# Altium schematic sheet Power_MPU.SchDoc: Power MPU
size A3; Date: Not used; ApprovedBy: Not used; CheckedBy: Not used; Author: Not used; CompanyName: STMicroelectronics; DrawnBy: Not used; Engineer: Not used; Organization: Not used; Address1: Not used; Address2: Not used; Address3: Not used; Address4: Not used; DocumentNumber: Not used; Revision: Not used; SheetNumber: 5; SheetTotal: 18; CurrentTime: Not used; CurrentDate: Not used; Time: Not used; DocumentFullPathAndName: Not used; DocumentName: Not used; ModifiedDate: Not used; ImagePath: Not used; ProjectName: Not used; Application_BuildNumber: Not used
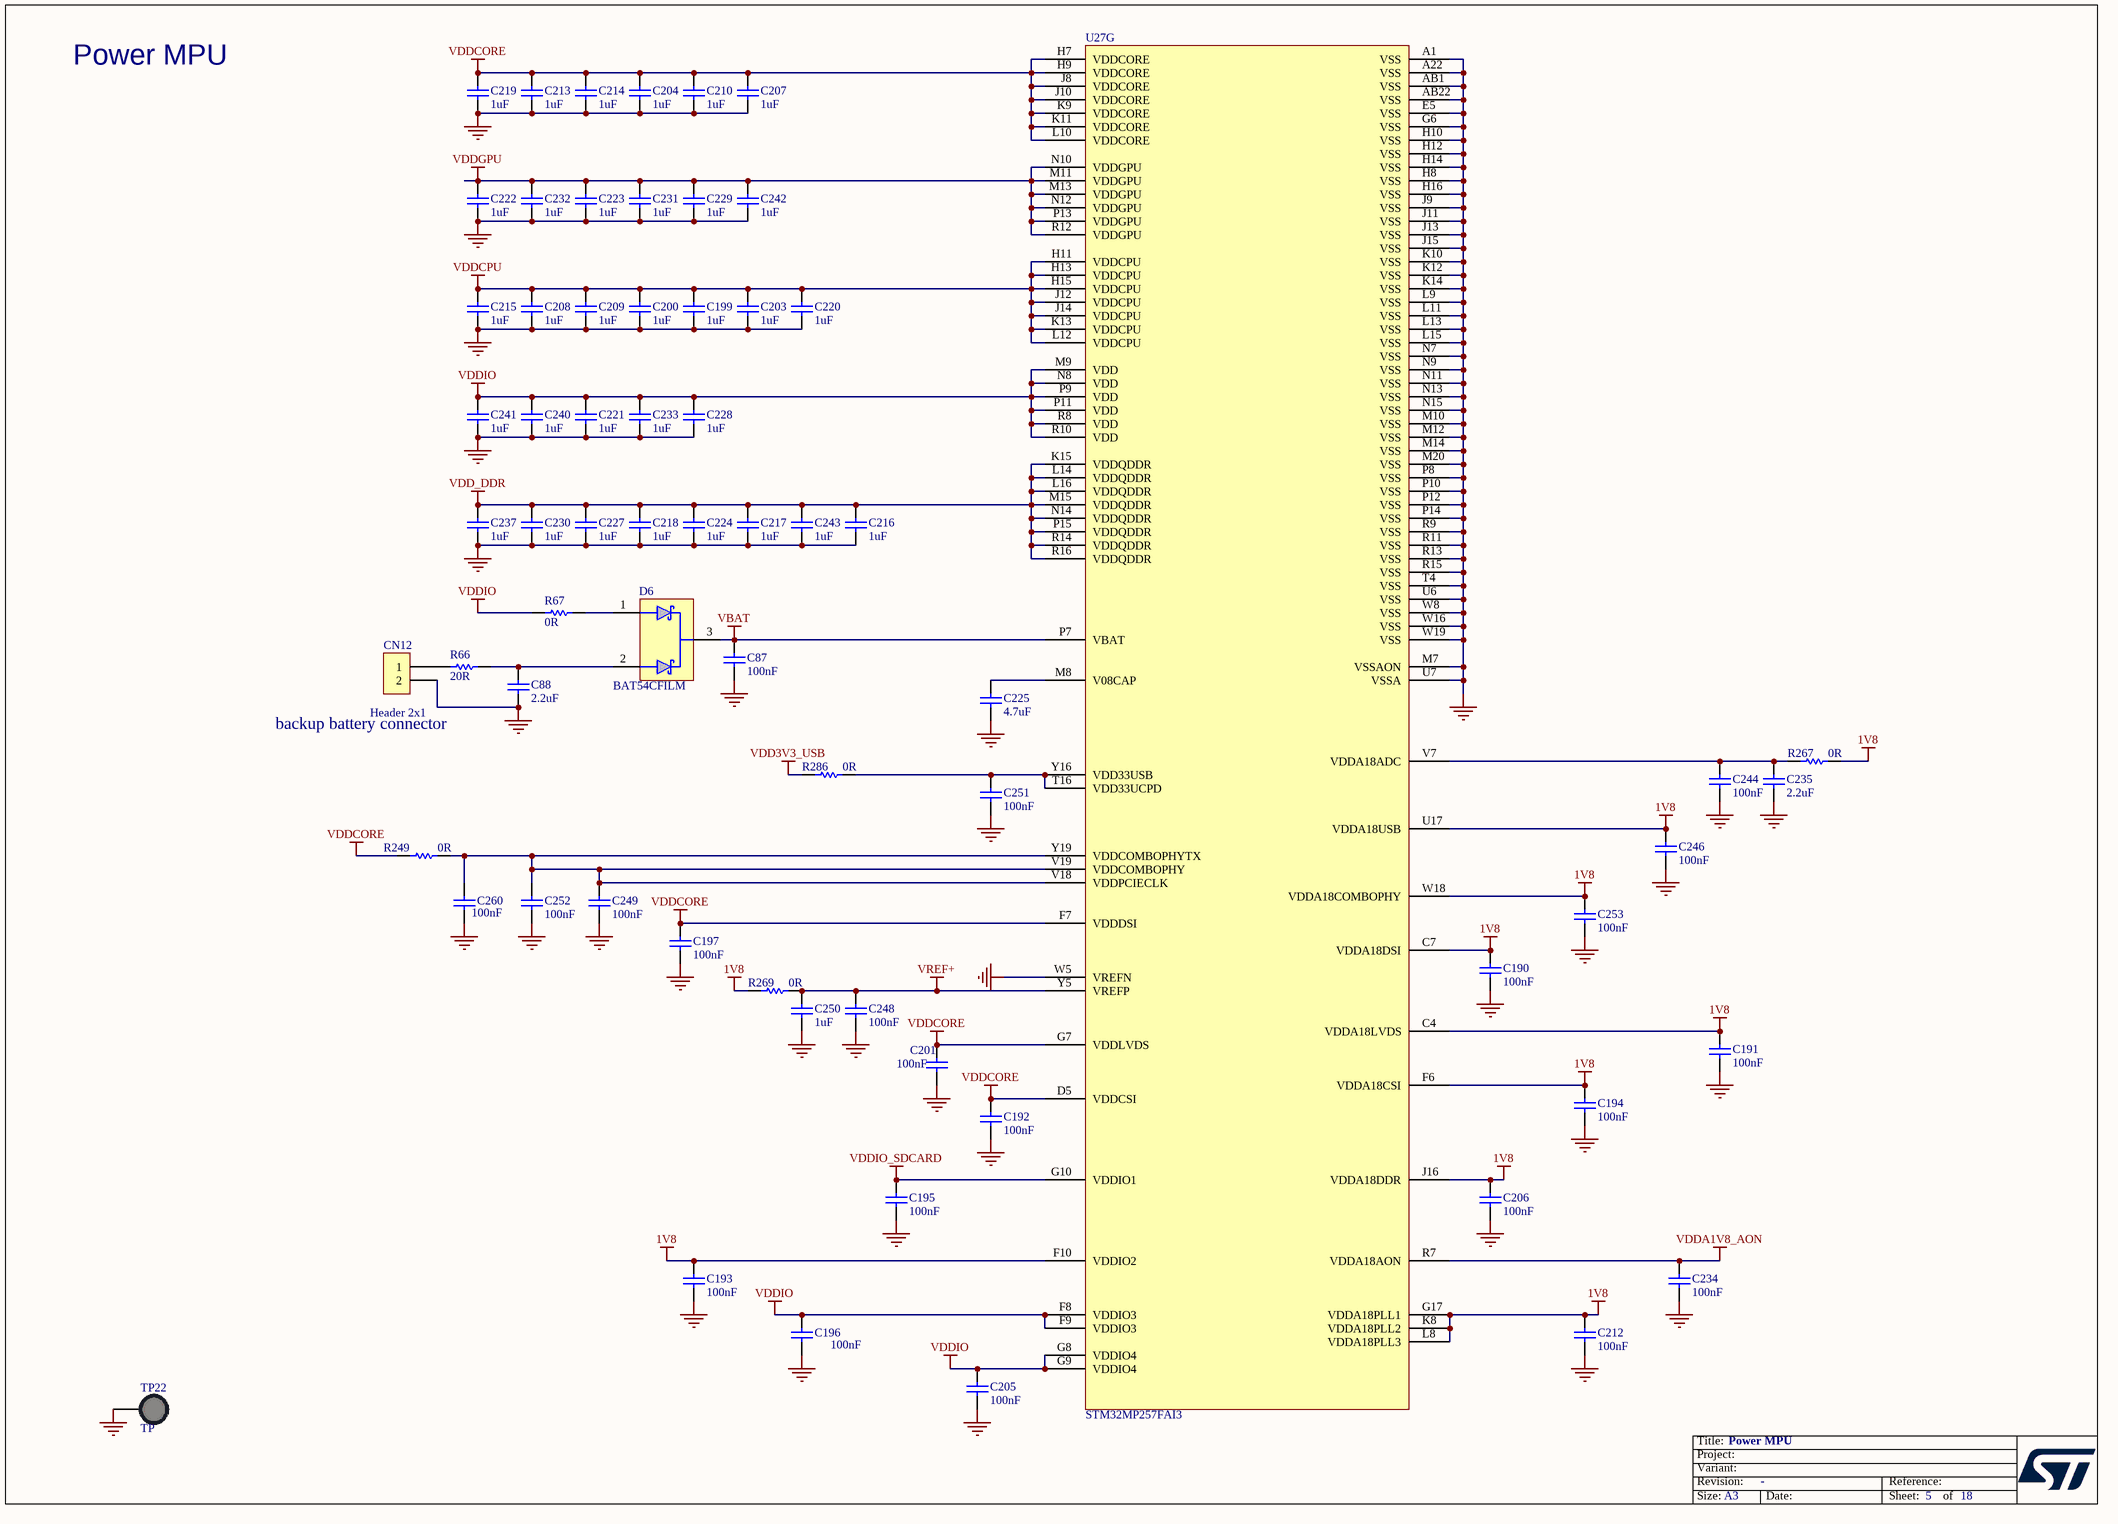
[diagram p0: Power_MPU.SchDoc]

## Parts
C87  value 100nF  [C0402]
C88  value 2.2uF  [C0402]  (hidden comment: Capacitor)
C190  value 100nF  [C0201_MURATA_GRM033_H0P3]  (hidden comment: Capacitor)
C191  value 100nF  [C0201_MURATA_GRM033_H0P3]  (hidden comment: Capacitor)
C192  value 100nF  [C0201_MURATA_GRM033_H0P3]  (hidden comment: Capacitor)
C193  value 100nF  [C0201_MURATA_GRM033_H0P3]  (hidden comment: Capacitor)
C194  value 100nF  [C0201_MURATA_GRM033_H0P3]  (hidden comment: Capacitor)
C195  value 100nF  [C0201_MURATA_GRM033_H0P3]  (hidden comment: Capacitor)
C196  value 100nF  [C0201_MURATA_GRM033_H0P3]  (hidden comment: Capacitor)
C197  value 100nF  [C0201_MURATA_GRM033_H0P3]  (hidden comment: Capacitor)
C199  value 1uF  [C0201_MURATA_GRM033_H0P3]  (hidden comment: Capacitor)
C200  value 1uF  [C0201_MURATA_GRM033_H0P3]  (hidden comment: Capacitor)
C201  value 100nF  [C0201_MURATA_GRM033_H0P3]  (hidden comment: Capacitor)
C203  value 1uF  [C0201_MURATA_GRM033_H0P3]  (hidden comment: Capacitor)
C204  value 1uF  [C0201_MURATA_GRM033_H0P3]  (hidden comment: Capacitor)
C205  value 100nF  [C0201_MURATA_GRM033_H0P3]  (hidden comment: Capacitor)
C206  value 100nF  [C0201_MURATA_GRM033_H0P3]  (hidden comment: Capacitor)
C207  value 1uF  [C0201_MURATA_GRM033_H0P3]  (hidden comment: Capacitor)
C208  value 1uF  [C0201_MURATA_GRM033_H0P3]  (hidden comment: Capacitor)
C209  value 1uF  [C0201_MURATA_GRM033_H0P3]  (hidden comment: Capacitor)
C210  value 1uF  [C0201_MURATA_GRM033_H0P3]  (hidden comment: Capacitor)
C212  value 100nF  [C0201_MURATA_GRM033_H0P3]  (hidden comment: Capacitor)
C213  value 1uF  [C0201_MURATA_GRM033_H0P3]  (hidden comment: Capacitor)
C214  value 1uF  [C0201_MURATA_GRM033_H0P3]  (hidden comment: Capacitor)
C215  value 1uF  [C0201_MURATA_GRM033_H0P3]  (hidden comment: Capacitor)
C216  value 1uF  [C0201_MURATA_GRM033_H0P3]  (hidden comment: Capacitor)
C217  value 1uF  [C0201_MURATA_GRM033_H0P3]  (hidden comment: Capacitor)
C218  value 1uF  [C0201_MURATA_GRM033_H0P3]  (hidden comment: Capacitor)
C219  value 1uF  [C0201_MURATA_GRM033_H0P3]  (hidden comment: Capacitor)
C220  value 1uF  [C0201_MURATA_GRM033_H0P3]  (hidden comment: Capacitor)
C221  value 1uF  [C0201_MURATA_GRM033_H0P3]  (hidden comment: Capacitor)
C222  value 1uF  [C0201_MURATA_GRM033_H0P3]  (hidden comment: Capacitor)
C223  value 1uF  [C0201_MURATA_GRM033_H0P3]  (hidden comment: Capacitor)
C224  value 1uF  [C0201_MURATA_GRM033_H0P3]  (hidden comment: Capacitor)
C225  value 4.7uF  [C0201_H0P5]  (hidden comment: Capacitor)
C227  value 1uF  [C0201_MURATA_GRM033_H0P3]  (hidden comment: Capacitor)
C228  value 1uF  [C0201_MURATA_GRM033_H0P3]  (hidden comment: Capacitor)
C229  value 1uF  [C0201_MURATA_GRM033_H0P3]  (hidden comment: Capacitor)
C230  value 1uF  [C0201_MURATA_GRM033_H0P3]  (hidden comment: Capacitor)
C231  value 1uF  [C0201_MURATA_GRM033_H0P3]  (hidden comment: Capacitor)
C232  value 1uF  [C0201_MURATA_GRM033_H0P3]  (hidden comment: Capacitor)
C233  value 1uF  [C0201_MURATA_GRM033_H0P3]  (hidden comment: Capacitor)
C234  value 100nF  [C0201_MURATA_GRM033_H0P3]  (hidden comment: Capacitor)
C235  value 2.2uF  [C0201_H0P5]  (hidden comment: Capacitor)
C237  value 1uF  [C0201_MURATA_GRM033_H0P3]  (hidden comment: Capacitor)
C240  value 1uF  [C0201_MURATA_GRM033_H0P3]  (hidden comment: Capacitor)
C241  value 1uF  [C0201_MURATA_GRM033_H0P3]  (hidden comment: Capacitor)
C242  value 1uF  [C0201_MURATA_GRM033_H0P3]  (hidden comment: Capacitor)
C243  value 1uF  [C0201_MURATA_GRM033_H0P3]  (hidden comment: Capacitor)
C244  value 100nF  [C0201_MURATA_GRM033_H0P3]  (hidden comment: Capacitor)
C246  value 100nF  [C0201_MURATA_GRM033_H0P3]  (hidden comment: Capacitor)
C248  value 100nF  [C0201_MURATA_GRM033_H0P3]  (hidden comment: Capacitor)
C249  value 100nF  [C0201_MURATA_GRM033_H0P3]  (hidden comment: Capacitor)
C250  value 1uF  [C0201_MURATA_GRM033_H0P3]  (hidden comment: Capacitor)
C251  value 100nF  [C0201_MURATA_GRM033_H0P3]  (hidden comment: Capacitor)
C252  value 100nF  [C0201_MURATA_GRM033_H0P3]  (hidden comment: Capacitor)
C253  value 100nF  [C0201_MURATA_GRM033_H0P3]  (hidden comment: Capacitor)
C260  value 100nF  [C0201_MURATA_GRM033_H0P3]  (hidden comment: Capacitor)
CN12  value Header 2x1  [CON_MOLEX_53047-0210]
D6  value BAT54CFILM  [DIO_SOT23]  (hidden comment: DIODE_3P_DUAL_COMMON_CATHODE)
R66  value 20R  [R0402]  (hidden comment: Resistor)
R67  value 0R  [R0402]  (hidden comment: Resistor)
R249  value 0R  [R0603]  (hidden comment: Resistor)
R267  value 0R  [R0402]
R269  value 0R  [R0402]
R286  value 0R  [R0402]
TP22  value TP  [TP_PTH-1P02MM_TEST-TERMINAL_RS_101-2391_BLACK]  (hidden comment: Test_pin_conn_black)
U27  STM32MP257FAI3  [ICC_LFBGA436_18X18_P080_H1P70_STM32MP257_CODE-B0D1]  (part G of 9)

## Nets
1V8: C190.2 C191.2 C193.2 C194.2 C206.2 C212.2 C246.2 C253.2 R267.2 R269.1 U27.C4(VDDA18LVDS) U27.C7(VDDA18DSI) U27.F6(VDDA18CSI) U27.F10(VDDIO2) U27.G17(VDDA18PLL1) U27.J16(VDDA18DDR) U27.K8(VDDA18PLL2) U27.L8(VDDA18PLL3) U27.U17(VDDA18USB) U27.W18(VDDA18COMBOPHY)
GND: C87.1 C88.1 C190.1 C191.1 C192.1 C193.1 C194.1 C195.1 C196.1 C197.1 C199.1 C200.2 C201.1 C203.1 C204.2 C205.1 C206.1 C207.1 C208.1 C209.1 C210.1 C212.1 C213.1 C214.1 C215.2 C216.1 C217.1 C218.1 C219.2 C220.1 C221.1 C222.1 C223.1 C224.1 C225.1 C227.1 C228.1 C229.2 C230.2 C231.1 C232.1 C233.2 C234.1 C235.1 C237.1 C240.1 C241.2 C242.1 C243.1 C244.1 C246.1 C248.1 C249.1 C250.1 C251.1 C252.1 C253.1 C260.1 CN12.2 TP22.1 U27.A1(VSS) U27.A22(VSS) U27.AB1(VSS) U27.AB22(VSS) U27.E5(VSS) U27.G6(VSS) U27.H8(VSS) U27.H10(VSS) U27.H12(VSS) U27.H14(VSS) U27.H16(VSS) U27.J9(VSS) U27.J11(VSS) U27.J13(VSS) U27.J15(VSS) U27.K10(VSS) U27.K12(VSS) U27.K14(VSS) U27.L9(VSS) U27.L11(VSS) U27.L13(VSS) U27.L15(VSS) U27.M7(VSSAON) U27.M10(VSS) U27.M12(VSS) U27.M14(VSS) U27.M20(VSS) U27.N7(VSS) U27.N9(VSS) U27.N11(VSS) U27.N13(VSS) U27.N15(VSS) U27.P8(VSS) U27.P10(VSS) U27.P12(VSS) U27.P14(VSS) U27.R9(VSS) U27.R11(VSS) U27.R13(VSS) U27.R15(VSS) U27.T4(VSS) U27.U6(VSS) U27.U7(VSSA) U27.W5(VREFN) U27.W8(VSS) U27.W16(VSS) U27.W19(VSS)
VBAT: C87.2 D6.3 U27.P7(VBAT)
VDD3V3_USB: R286.1
VDD_DDR: C216.2 C217.2 C218.2 C224.2 C227.2 C230.1 C237.2 C243.2 U27.K15(VDDQDDR) U27.L14(VDDQDDR) U27.L16(VDDQDDR) U27.M15(VDDQDDR) U27.N14(VDDQDDR) U27.P15(VDDQDDR) U27.R14(VDDQDDR) U27.R16(VDDQDDR)
VDDA1V8_AON: C234.2 U27.R7(VDDA18AON)
VDDCORE: C192.2 C197.2 C201.2 C204.1 C207.2 C210.2 C213.2 C214.2 C219.1 R249.1 U27.D5(VDDCSI) U27.F7(VDDDSI) U27.G7(VDDLVDS) U27.H7(VDDCORE) U27.H9(VDDCORE) U27.J8(VDDCORE) U27.J10(VDDCORE) U27.K9(VDDCORE) U27.K11(VDDCORE) U27.L10(VDDCORE)
VDDCPU: C199.2 C200.1 C203.2 C208.2 C209.2 C215.1 C220.2 U27.H11(VDDCPU) U27.H13(VDDCPU) U27.H15(VDDCPU) U27.J12(VDDCPU) U27.J14(VDDCPU) U27.K13(VDDCPU) U27.L12(VDDCPU)
VDDGPU: C222.2 C223.2 C229.1 C231.2 C232.2 C242.2 U27.M11(VDDGPU) U27.M13(VDDGPU) U27.N10(VDDGPU) U27.N12(VDDGPU) U27.P13(VDDGPU) U27.R12(VDDGPU)
VDDIO: C196.2 C205.2 C221.2 C228.2 C233.1 C240.2 C241.1 R67.2 U27.F8(VDDIO3) U27.F9(VDDIO3) U27.G8(VDDIO4) U27.G9(VDDIO4) U27.M9(VDD) U27.N8(VDD) U27.P9(VDD) U27.P11(VDD) U27.R8(VDD) U27.R10(VDD)
VDDIO_SDCARD: C195.2 U27.G10(VDDIO1)
VREF+: C248.2 C250.2 R269.2 U27.Y5(VREFP)
NetC88_2: C88.2 D6.2 R66.2
NetC225_2: C225.2 U27.M8(V08CAP)
NetC235_2: C235.2 C244.2 R267.1 U27.V7(VDDA18ADC)
NetC249_2: C249.2 C252.2 C260.2 R249.2 U27.V18(VDDPCIECLK) U27.V19(VDDCOMBOPHY) U27.Y19(VDDCOMBOPHYTX)
NetC251_2: C251.2 R286.2 U27.T16(VDD33UCPD) U27.Y16(VDD33USB)
NetCN12_1: CN12.1 R66.1
NetD6_1: D6.1 R67.1

## Notes on the sheet
- Power MPU
- backup battery connector
- Title:
- Project:
- Size:
- Revision:
- Variant:
- A3
- -
- Date:
- Reference:
- Sheet:
- of

## Library data of the parts
C87 = MCD-00006: Capacitor,100nF,16V,X7R,10%,0402; Manufacturer_Part_Number: CC0402KRX7R7BB104; Manufacturer: YAGEO; Alternate_Manufacturer: MURATA; Alternate_Manufacturer_Part_Number: GCM155R71C104KA55D; Part_Preference: Recommended; Partial_Alternate_Internal_Part_Number: MCD-03299; Provided_By: SUBCO; Initial_Board_Reference: MB1274; Order_Code_RS: 616-9701; Component_Country_Of_Origin: China; ID: 2474; ShowFields: YES; Alternate_EMS: M; Internal_Part_Number: MCD-00006; ComponentLink1Description: Datasheet; ECCN_US: n/a; ECCN_EU: n/a; Status: Released; Part_Type: Capacitor; Package: 0402; ComponentLink1URL: http://tunmcdsvn.tun.st.com/Component_Documentation_Library/Trunk/Capacitor/YAGEO_X7R_Series; Order_Code_Digikey: 311-1338-1-ND; Order_Code_Farnell: 9402047
C88 = MCD-01823: Capacitor, MLCC, 2.2uF, 6V3, X5R,+/-10%, 0402, T=0.5mm; Part_Preference: Recommended; Manufacturer: MURATA; Manufacturer_Part_Number: GRM155R60J225KE95D; Order_Code_RS: 172-6478; Component_Country_Of_Origin: Japan; ID: 3923; ShowFields: YES; Internal_Part_Number: MCD-01823; Status: Released; Part_Type: Capacitor; Alternate_Manufacturer: N/A; Alternate_Manufacturer_Part_Number: N/A; Package: 0402; ComponentLink1URL: http://tunmcdsvn.tun.st.com/Component_Documentation_Library/Trunk/Capacitor/MURATA_GRM_Series; Order_Code_Digikey: 490-12532-1-ND; Order_Code_Farnell: 2695865
C190-C197 C201 C205 C206 C212 C234 C244 C246 C248 C249 C251-C253 C260 = MCD-01535: Capacitor, MLCC,100nF, 10V, X7R, +/-10%, 0201, T=0.3mm; Part_Preference: Recommended; Manufacturer: MURATA; Manufacturer_Part_Number: GRM033R61A104KE15; Order_Code_RS: 790-2742; Internal_Part_Number: MCD-01535; Status: Checked; Part_Type: Capacitor; Alternate_Manufacturer: N/A; Alternate_Manufacturer_Part_Number: N/A; Package: 0201; ComponentLink1URL: http://tunmcdsvn.tun.st.com/Component_Documentation_Library/Trunk/Capacitor/MURATA_GRM_Series; Order_Code_Digikey: 490-5881-1-ND; Order_Code_Farnell: 2470450
C199 C200 C203 C204 C207-C210 C213-C224 C227-C233 C237 C240-C243 C250 = MCD-02377: Capacitor, MLCC, 1uF, 6.3V, X5R, +/-20%, 0201, T=0,3mm; Manufacturer_Part_Number: GRM033R60J105MEA2; Manufacturer: MURATA; Part_Preference: Recommended; Order_Code_RS: 820-0643; Status: Checked; Internal_Part_Number: MCD-02377; Part_Type: Capacitor; Alternate_Manufacturer_Part_Number: N/A; Alternate_Manufacturer: N/A; Package: 0201; ComponentLink1URL: http://tunmcdsvn.tun.st.com/Component_Documentation_Library/Trunk/Capacitor/MURATA_GRM_Series/GRM033R60J105MEA2/; Order_Code_Digikey: 490-7229-2-ND; Order_Code_Farnell: 2470448
C225 = MCD-01534: Capacitor, MLCC, 4,7uF, 6V3, X5R, +/-20%, 0201, T=0.5mm; Part_Preference: Recommended; Manufacturer: MURATA; Manufacturer_Part_Number: GRM035R60J475ME15; Internal_Part_Number: MCD-01534; Status: Checked; Part_Type: Capacitor; Alternate_Manufacturer: N/A; Alternate_Manufacturer_Part_Number: N/A; Package: 0201; ComponentLink1URL: http://tunmcdsvn.tun.st.com/Component_Documentation_Library/Trunk/Capacitor/MURATA_GRM_Series; Order_Code_Digikey: 490-13230-1-ND; Order_Code_Farnell: N/A; Order_Code_RS: N/A
C235 = MCD-02235: Capacitor, MLCC, 2.2uF, 10V, X5R,+/-10%, 0201, T=0.5mm; Part_Preference: Recommended; Manufacturer: MURATA; Manufacturer_Part_Number: GRM033R61A225KE47D; Order_Code_RS: NA; Component_Country_Of_Origin: Japan; ShowFields: YES; ID: 4335; Internal_Part_Number: MCD-02235; Status: Checked; Part_Type: Capacitor; Package: 0201; ComponentLink1URL: http://tunmcdsvn.tun.st.com/Component_Documentation_Library/Trunk/Capacitor/MURATA_GRM_Series; Order_Code_Digikey: 490-13227-1-ND; Order_Code_Farnell: NA
CN12 = MCD-00655: Header 2 circuits, 1.25mm Pitch ,  Vertical, with Friction Lock; Part_Type: Connector; Manufacturer_Part_Number: 53047-0210; Manufacturer: MOLEX; BMS_Part_Number: 9083002; Part_Preference: Recommended; Provided_By: SUBCO; Initial_Board_Reference: MB1272; Order_Code_RS: 279-9213; Component_Country_Of_Origin: Unknown; ID: 3091; ShowFields: YES; Internal_Part_Number: MCD-00655; Status: Released; ComponentLink1Description: Datasheet; ComponentLink1URL: http://tunmcdsvn.tun.st.com/Component_Documentation_Library/Trunk/Connector/MOLEX_53047-0210/; ECCN_US: n/a; ECCN_EU: n/a; Alternate_Manufacturer: N/A; Alternate_Manufacturer_Part_Number: N/A; Order_Code_Digikey: WM1731-ND; Order_Code_Farnell: 9733051
D6 = MCD-03280: Diode, Schottky, Dual Common Cathode, 0V3, 300mA, 40V, SOT-23; Part_Preference: Recommended; Manufacturer: STMICROELECTRONICS; Full_Alternate_Internal_Part_Number: BAT54C+, BAT54CLT1G, BAT54C-7-F, BAT54C,215; Order_code_RS: 795-8397; Component_Country_Of_Origin: China; ShowFields: YES; ID: 5396; Order_code_Digikey: N/A; Order_code_Farnell: 9801499; Status: New; ComponentLink1URL: http://tunmcdsvn.tun.st.com/Component_Documentation_Library/Trunk/Diode/STMICROELECTRONICS_BAT54_Series; Internal_Part_Number: MCD-03280; Part_Type: Diode; Manufacturer_Part_Number: BAT54CFILM; Package: SOT-23
R66 = MCD-00058: Resistor, 20R, 0402, +/-1%, 1/16W; BMS_Part_Number: 9131027; Part_Preference: Recommended; Manufacturer: YAGEO; Manufacturer_Part_Number: RC0402FR-0720RL; Component_Country_Of_Origin: China; ID: 2537; ShowFields: YES; Internal_Part_Number: MCD-00058; Status: Released; Part_Type: Resistor; Alternate_Manufacturer: N/A; Alternate_Manufacturer_Part_Number: N/A; Package: 0402; ComponentLink1URL: http://tunmcdsvn.tun.st.com/Component_Documentation_Library/Trunk/Resistor/YAGEO_RC_L_Series; Order_Code_Digikey: 311-20LRCT-ND; Order_Code_Farnell: 1799192; Order_Code_RS: N/A
R67 = MCD-00052: Resistor, 0R, 0402, +/-5%, 1/16W; Manufacturer_Part_Number: RC0402JR-070RL; Manufacturer: YAGEO; Part_Preference: Recommended; Order_Code_RS: 618-5804; Component_Country_Of_Origin: China; ShowFields: YES; ID: 2540; Internal_Part_Number: MCD-00052; Status: Released; Part_Type: Resistor; ComponentLink1URL: http://tunmcdsvn.tun.st.com/Component_Documentation_Library/Trunk/Resistor/YAGEO_RC_L_Series; Package: 0402; Order_Code_Digikey: 311-0.0JRCT-ND; Order_Code_Farnell: 9232516RL
R249 = MCD-00056: Resistor, 0R, 0603, +/-5%, 1/10W; Part_Preference: Recommended; Manufacturer: YAGEO; Manufacturer_Part_Number: RC0603JR-070RL; Component_Country_Of_Origin: China; ShowFields: YES; ID: 2536; Internal_Part_Number: MCD-00056; Status: Released; Part_Type: Resistor; Package: 0603; ComponentLink1URL: http://tunmcdsvn.tun.st.com/Component_Documentation_Library/Trunk/Resistor/YAGEO_RC_L_Series; Order_Code_Digikey: 311-0.0GRCT-ND; Order_Code_Farnell: 9233130RL; Order_Code_RS: N/A
R267 R269 R286 = MCD-00052: Resistor,0R,0402,5%,1/16W; Manufacturer_Part_Number: RC0402JR-070RL; Manufacturer: YAGEO; Part_Preference: Recommended; ECCN_US: EAR99; ECCN_EU: NEC; Provided_By: SUBCO; Initial_Board_Reference: mb1274; Order_Code_RS: 618-5804; Internal_Part_Number: MCD-00052; ComponentLink1Description: Datasheet; Status: Released; Part_Type: Resistor; ComponentLink1URL: http://tunmcdsvn.tun.st.com/Component_Documentation_Library/Trunk/Resistor/YAGEO_RC_L_Series; Package: 0402; Alternate_Manufacturer: N/A; Alternate_Manufacturer_Part_Number: N/A; Order_Code_Digikey: 311-0.0JRCT-ND; Order_Code_Farnell: 9232516RL
TP22 = MCD-00713: Vero Technologies 1.02mm Black Terminal Post; Part_Type: Misc; Manufacturer_Part_Number: 20-2137; Part_Preference: Recommended; Order_Code_RS: 101-2391; Provided_By: SUBCO; Internal_Part_Number: MCD-00713; Status: Released; Manufacturer: VERO; ComponentLink1Description: Datasheet; ComponentLink1URL: http://tunmcdsvn.tun.st.com/Component_Datasheet_Library/Trunk/Misc/Vero_TestPin_20-2137; ECCN_US: n/a; ECCN_EU: n/a
U27 = MCD-02000: MPU, ARM Cortex-A35 + M33 32-bit MPU, 808KB RAM, With Crypto; Part_Type: IC; Part_Preference: Recommended; Manufacturer: STMICROELECTRONICS; Manufacturer_HQ_COO: EU; Component_Country_Of_Origin: Unknown; ShowFields: YES; ID: 4100; Internal_Part_Number: MCD-02000; Value: STM32MP257FAI3; Status: Checked; Manufacturer_Part_Number: STM32MP257FAI3; Package: LFBGA-436; ComponentLink1URL: http://tunmcdsvn.tun.st.com/Component_Documentation_Library/Trunk/IC/STMICROELECTRONICS_STM32MP257FAI3; Order_Code_Digikey: N/A; Order_Code_Farnell: N/A; Order_Code_RS: N/A